# Altium schematic sheet Supply.SchDoc
size A4; CheckedBy: Everyone how cares; DocumentNumber: 2; SheetNumber: 2; SheetTotal: 4
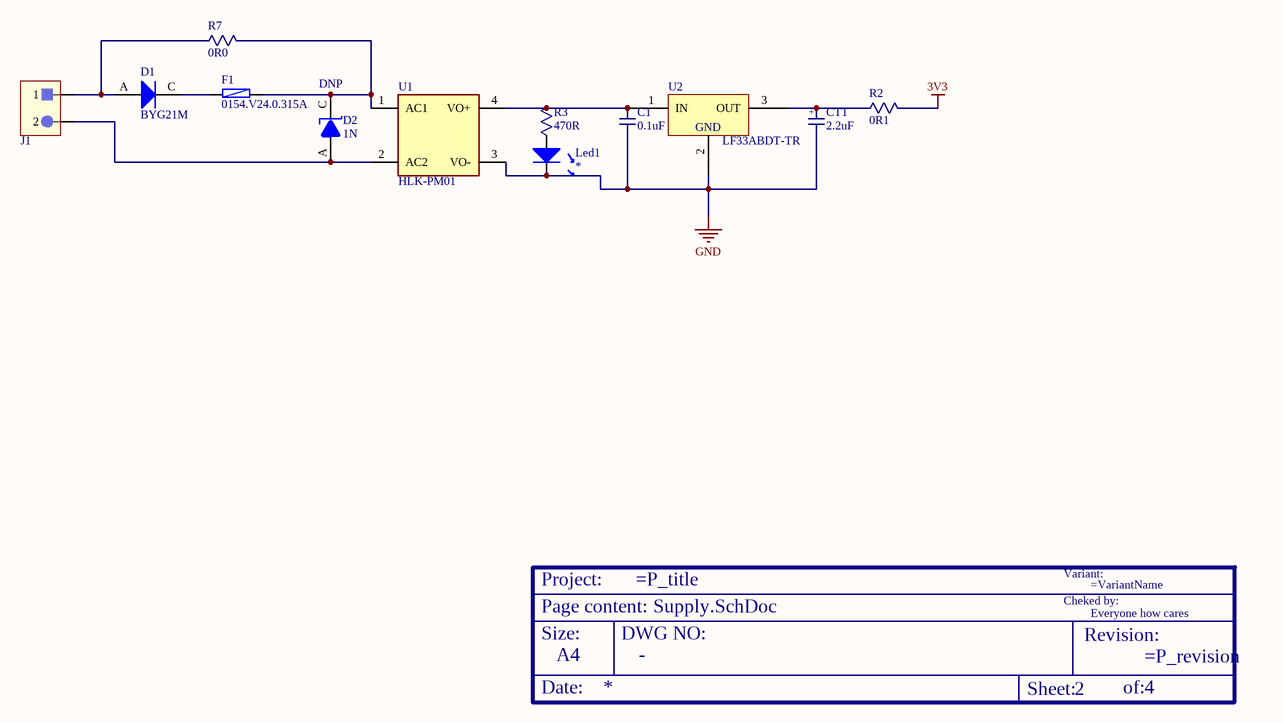
[diagram p0: Supply.SchDoc]

## Parts
?  Size: A4  (hidden comment: TitleBox)  (graphical)
C1  value 0.1uF  [0603C]  (hidden comment: Ceramic Capacitor)
CT1  value 2.2uF  [1206T]  (hidden comment: Tantalum capacitor)
D1  value BYG21M  [DO-214AC]  (hidden comment: DNP)
D2  DNP  value 1N  [1N5359BG]
F1  value 0154.V24.0.315A  [Fuseholder154]  (hidden comment: DNP)
J1  Conector  [691313510002]  (value not drawn)
Led1  Led  [LED_5MM_RED_1C-2A]  (value not drawn)
R2  value 0R1  [0603]  (hidden comment: Res)
R3  value 470R  [0603]  (hidden comment: Res)
R7  value 0R0  [0805]  (hidden comment: Res)
U1  HLK-PM01  [HLK-PM01/ISE]
U2  value LF33ABDT-TR  [DPAK-TO-252-3, CASE369C]  (hidden comment: LDO)

## Nets
3V3: R2.2
GND: C1.2 CT1.2 Led1.C U1.3(VO-) U2.2(GND)
NetC1_1: C1.1 R3.2 U1.4(VO+) U2.1(IN)
NetCT1_1: CT1.1 R2.1 U2.3(OUT)
NetD1_A: D1.A J1.1 R7.1
NetD1_C: D1.C F1.1
NetD2_A: D2.A J1.2 U1.2(AC2)
NetD2_C: D2.C F1.2 R7.2 U1.1(AC1)
NetLed1_A: Led1.A R3.1

## Notes on the sheet
- (in symbol CT) +
- (in symbol TitleBox_1) Variant:; Project:; Cheked by:; Page content:; Size:; DWG NO:; Revision:; Date:; Sheet:; of:

## Library data of the parts
? = TitleBox_1: coordenadas: (610;20) Size A4; DWG No: -
C1 = CC: notas: *
CT1 = CT: Condensador Tantalum; notas: *
D1 = Diode: notas: 24Vin
D2 = Zener Diode: notas: *
F1 = Fusivel_LITTELFUSE_0154: Fusivel SMD LITTELFUSE  0154; notas: 24Vin
J1 = Conector 2 pins: notas: *
R7 = Res: notas: AC
U1 = HLK-PM01: HI-LINK Ultra-compact power module HLK-PM01<p> <ul> <li>Meet UL, CE requirements</li> <li>Ultra-thin, ultra-small</li> <li>All voltage input (AC: 90 ~ 264V)</li> <li>Low ripple and low noise</li> <li>Output overload and short circuit protection</li> <li>High efficiency, high power density</li> <li>The product is designed to meet the requirements of EMC and Safety Test</li> <li>Low power consumption, environmental protection, no-load loss <0.1W</li> <li>100% load aging and testing</li>; Availability: Unavailable; Price: None; SnapEDA_Link: https://www.snapeda.com/parts/hlk-pm01/Hi-link/view-part/2875605/?ref=snap; Value: *; Package: Package Analog Devices; MF: Hi-link; MP: hlk-pm01
U2 = LF33ABDT-TR: ST, LF33ABDT-TR, Fixed LDO Voltage Regulator, 3V to 16V, 400mV Dropout, 3.3Vout, 0.5Aout, TO-252-3; Manufacturer: STMICROELECTRONICS; Input Voltage Min: 3; Input Voltage Max: 16; Output Voltage Nom.: 3.3; Output Current: 0.5; Dropout Voltage Vdo: 400; LDO Regulator Case Style: TO-252; SVHC: No SVHC (15-Jun-2015); Accuracy %: 1%; Base Number: 33; No. of Outputs: 1; Operating Voltage Tolerance +: 2%; Primary Input Voltage: 5.3; Supply Voltage Min: 4.3; Voltage Regulator Type: Fixed<!--FANDB--><div class="features-and-benefits-container"><div class="features-and-benefits-description"><span class="features-benefits-value">The LF33ABDT-TR is a Low-drop Voltage Regulator with inhibit function and 3.3V output voltage. Low quiescent current make it particularly suitable for low-noise, low power applications and especially in battery powered systems. In the 5-pin configuration (PPAK) a shutdown logic control function is available (pin 2, TTL compatible). This means that when the device is used as a local regulator, a part of the board can be put in standby, decreasing the total power consumption. In the 3-terminal configuration, the device has the same electrical performance, but it is fixed in ON state. It requires a capacitor of only 2.2µF for stability, saving board space and costs.</span></div><div class="features-and-benefits-list"><ul class="features-and-benefits-list-list"><li class="features-and-benefits-list-item">Very low drop-out voltage (0.45V)</li><li class="features-and-benefits-list-item">Very low quiescent current (typical 50µA in OFF mode, 500µA in ON mode)</li><li class="features-and-benefits-list-item">500mA Output current</li><li class="features-and-benefits-list-item">Logic-controlled electronic shutdown</li><li class="features-and-benefits-list-item">Internal current and thermal limit</li><li class="features-and-benefits-list-item">Available in ±1% (AB) or ±2% (C) selection at 25°C</li><li class="features-and-benefits-list-item">80; Supplier 1: Farnell; Manufacturer Part Number: LF33ABDT-TR; RoHS: YES; Stock 1: 7182; Pricing 1: 1=0,52, 70=0,33, 200=0,297, 750=0,264, 1250=0,25 (EUR); No. of Pins: 3; Operating Temperature Min: -40; Operating Temperature Max: 125; Packaging: Cut Tape; MSL: -; Operating Temperature Range: -40°C to +125; Supply Voltage Max: 16; Termination Type: SMD; ComponentLink1URL: http://www.farnell.com/datasheets/1902868.pdf; ComponentLink1Description: http://www.farnell.com/datasheets/1902868.pdf; Supplier Part Number 1: 1087183; notas: *
Led1 = Led: notas: *; Value: *
R2 R3 = Res: notas: *